# Altium schematic sheet LTE+GPS_Power.SchDoc
size 420 x 297 mm
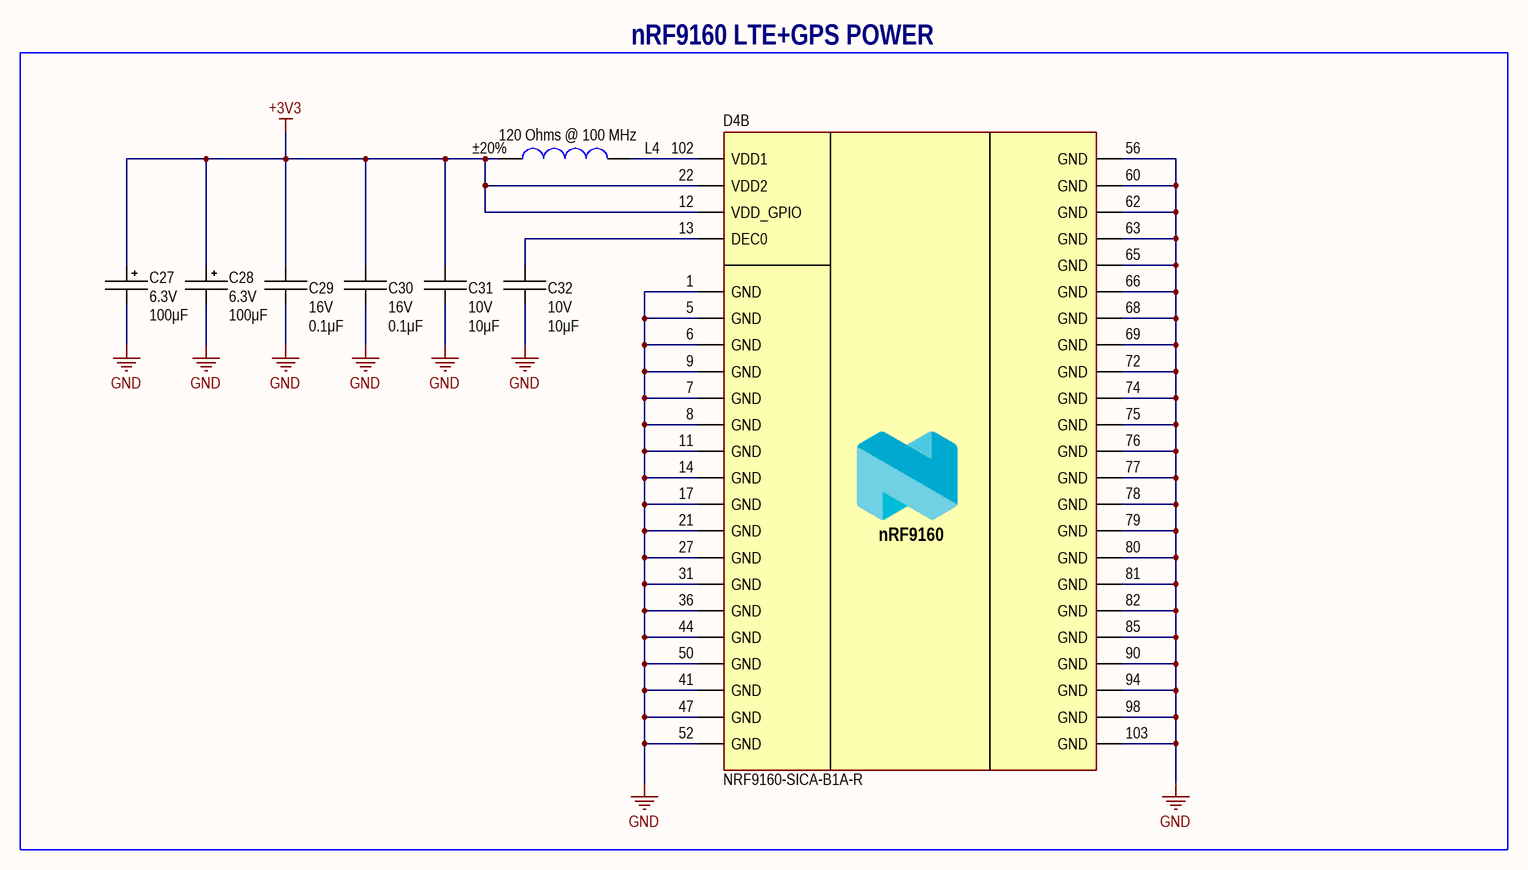
[diagram p0: LTE+GPS_Power.SchDoc]

## Parts
C27  value 100μF  Voltage: 6.3V  [CAP: TANTAL-A]
C28  value 100μF  Voltage: 6.3V  [CAP: TANTAL-A]
C29  value 0.1μF  Voltage: 16V  [CAP: 0805]
C30  value 0.1μF  Voltage: 16V  [CAP: 0805]
C31  value 10μF  Voltage: 10V  [CAP: 0805]
C32  value 10μF  Voltage: 10V  [CAP: 0805]
D4  PartNumber: NRF9160-SICA-B1A-R  [MOD: NRF9160]  (part B of 3)
L4  value 120 Ohms @ 100 MHz  Tolerance: ±20%  [IND: 0805]

## Blocks framed on the sheet
nRF9160 LTE+GPS POWER: C27-C32 D4 L4

## Nets
+3V3: C27.1 C28.1 C29.2 C30.2 C31.2 D4.12(VDD_GPIO) D4.22(VDD2) L4.2
GND: C27.2 C28.2 C29.1 C30.1 C31.1 C32.1 D4.1(GND) D4.5(GND) D4.6(GND) D4.7(GND) D4.8(GND) D4.9(GND) D4.11(GND) D4.14(GND) D4.17(GND) D4.21(GND) D4.27(GND) D4.31(GND) D4.36(GND) D4.41(GND) D4.44(GND) D4.47(GND) D4.50(GND) D4.52(GND) D4.56(GND) D4.60(GND) D4.62(GND) D4.63(GND) D4.65(GND) D4.66(GND) D4.68(GND) D4.69(GND) D4.72(GND) D4.74(GND) D4.75(GND) D4.76(GND) D4.77(GND) D4.78(GND) D4.79(GND) D4.80(GND) D4.81(GND) D4.82(GND) D4.85(GND) D4.90(GND) D4.94(GND) D4.98(GND) D4.103(GND)
NetC32_2: C32.2 D4.13(DEC0)
NetD4_102: D4.102(VDD1) L4.1

## Notes on the sheet
- Author
- Manufacturer
- Date
- Page
- Total pages
- Size page
- A3
- Materials

## Library data of the parts
C27 C28 = Tantal_A: 100 µF Molded Tantalum Polymer Capacitor 6.3 V 1206 (3216 Metric) 100mOhm @ 100kHz; Manufacturer: AVX; PartNumber: TCJA107M006R0100; ValueManufacturerPartNumber: Tantalum capacitor, 100μF, 6.3V, ±10%, 100 mOhm, case A (3216), -55...+125°C; Tolerance: ±10%; TypeDielectric: X7R; TypeCapacitor: Tantalum capacitor; Package: case A (3216); HelpURL: https://www.digikey.com/en/products/detail/avx-corporation/TCJA107M006R0100/4990371; Temperature: -55...+125°C; Impedance: 100 mOhm
C29 C30 = Ceramic_0805: Manufacturer: Yageo; PartNumber: CC0805KRX7R7BB104; ValueManufacturerPartNumber: Ceramic capacitor, 0.1μF, X7R, ±10%, 16V, 0805, -55...+125°C; TypeCapacitor: Ceramic capacitor; Tolerance: ±10%; TypeDielectric: X7R; Package: 0805; HelpURL: https://www.digikey.com/product-detail/en/yageo/CC0805KRX7R7BB104/311-1142-1-ND/303052; Temperature: -55...+125°C
C31 C32 = Ceramic_0805: 10 µF ±10% 10V Ceramic Capacitor X7R 0805 (2012 Metric); Manufacturer: Yageo; PartNumber: CC0805KFX7R6BB106; ValueManufacturerPartNumber: Ceramic capacitor, 10μF, X7R, ±10%, 10V, 0805, -55...+125°C; Package: 0805; HelpURL: https://www.digikey.com/en/products/detail/yageo/CC0805KFX7R6BB106/11611326; Temperature: -55...+125°C; TypeCapacitor: Ceramic capacitor; Tolerance: ±10%; TypeDielectric: X7R
D4 = nRF9160: LTE/GSM module; Manufacturer: Nordic Semiconductor; Supply: 3...5.5V; Frequency: 2.4GHz; TypeProtocol: LTE-M/NB-IoT/GPS; HelpURL: https://www.digikey.com/en/products/detail/nordic-semiconductor-asa/NRF9160-SICA-B1A-R/13533595; Package: 127-LGA; ComponentType: LTE/GSM module; ValueManufacturerPartNumber: =ComponentType+', '+TypeProtocol+', '+Frequency+', '+CoreSize+', '+CoreProcessor+', '+MemoryROM+', '+MemoryRAM+', '+Supply+', '+Temperature+', '+Package; Temperature: -40...+85°C
L4 = Inductor_0805: 120 Ohms @ 100 MHz 1 Power Line Ferrite Bead 0805 (2012 Metric) 3A 30mOhm; Manufacturer: Murata Electronics; PartNumber: BLM21PG121SH1D; ValueManufacturerPartNumber: Fixed inductor, 120 Ohms @ 100 MHz, ±20%, 0805, 3A, -55...+125°C; TypeInductor: Fixed inductor; Package: 0805; HelpURL: https://www.digikey.com/en/products/detail/murata-electronics/BLM21PG121SH1D/4419690; Temperature: -55...+125°C; MaxCurrent: 3A